# Altium schematic sheet Schematic.SchDoc
size A; DocumentNumber: 1; SheetNumber: 1; SheetTotal: 2
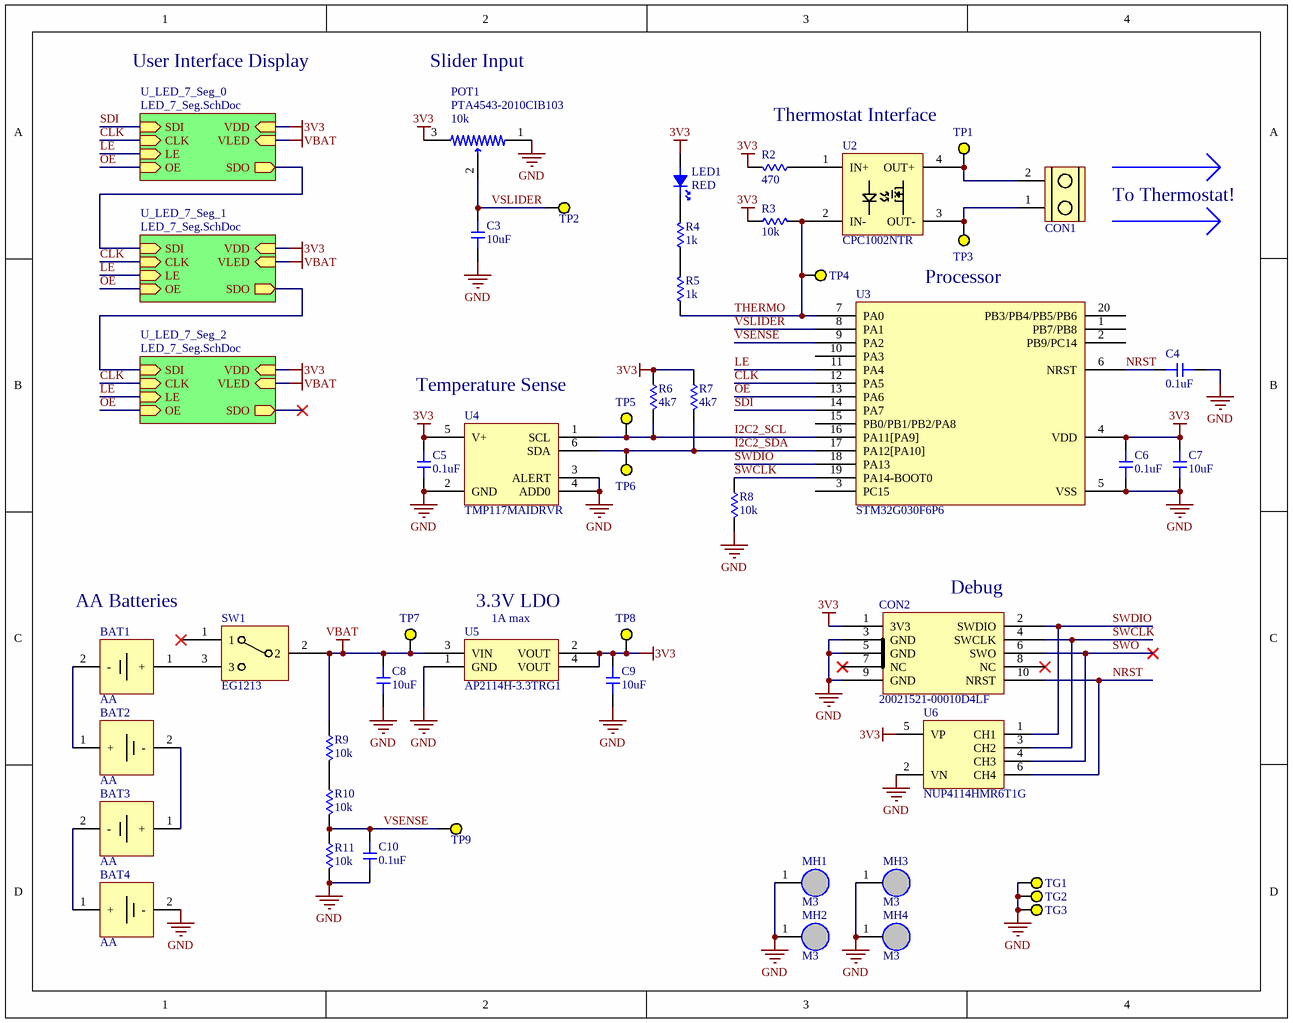
[diagram p0: Schematic.SchDoc]

## Parts
BAT1  AA  [AA_BATTERY]
BAT2  AA  [AA_BATTERY]
BAT3  AA  [AA_BATTERY]
BAT4  AA  [AA_BATTERY]
C3  value 10uF  [0603-CAP]  (hidden comment: Capacitor)
C4  value 0.1uF  [0603-CAP]  (hidden comment: Capacitor)
C5  value 0.1uF  [0603-CAP]  (hidden comment: Capacitor)
C6  value 0.1uF  [0603-CAP]  (hidden comment: Capacitor)
C7  value 10uF  [0603-CAP]  (hidden comment: Capacitor)
C8  value 10uF  [0603-CAP]  (hidden comment: Capacitor)
C9  value 10uF  [0603-CAP]  (hidden comment: Capacitor)
C10  value 0.1uF  [0603-CAP]  (hidden comment: Capacitor)
CON1  ScrewTerminal_1x2  [1935161]  (value not drawn)
CON2  20021521-00010D4LF  [20021521-00010D4LF]
LED1  RED  [0603-LED]
MH1  M3  [M3_HOLE]  (no BOM)
MH2  M3  [M3_HOLE]  (no BOM)
MH3  M3  [M3_HOLE]  (no BOM)
MH4  M3  [M3_HOLE]  (no BOM)
POT1  PTA4543-2010CIB103  value 10k  [PTA4543-2010CIB103]
R2  value 470  [0603-RES]  (hidden comment: Resistor)
R3  value 10k  [0603-RES]  (hidden comment: Resistor)
R4  value 1k  [0603-RES]  (hidden comment: Resistor)
R5  value 1k  [0603-RES]  (hidden comment: Resistor)
R6  value 4k7  [0603-RES]  (hidden comment: Resistor)
R7  value 4k7  [0603-RES]  (hidden comment: Resistor)
R8  value 10k  [0603-RES]  (hidden comment: Resistor)
R9  value 10k  [0603-RES]  (hidden comment: Resistor)
R10  value 10k  [0603-RES]  (hidden comment: Resistor)
R11  value 10k  [0603-RES]  (hidden comment: Resistor)
SW1  EG1213  [EG1213]
TG1  RCU-0C  [RCU-0C]  (value not drawn)
TG2  RCU-0C  [RCU-0C]  (value not drawn)
TG3  RCU-0C  [RCU-0C]  (value not drawn)
TP1  RCU-0C  [RCU-0C]  (value not drawn)
TP2  RCU-0C  [RCU-0C]  (value not drawn)
TP3  RCU-0C  [RCU-0C]  (value not drawn)
TP4  RCU-0C  [RCU-0C]  (value not drawn)
TP5  RCU-0C  [RCU-0C]  (value not drawn)
TP6  RCU-0C  [RCU-0C]  (value not drawn)
TP7  RCU-0C  [RCU-0C]  (value not drawn)
TP8  RCU-0C  [RCU-0C]  (value not drawn)
TP9  RCU-0C  [RCU-0C]  (value not drawn)
U2  CPC1002NTR  [CPC1002NTR]
U3  STM32G030F6P6  [TSOP65P640X120-20N]
U4  TMP117MAIDRVR  [SON65P200X80_HS-7N]
U5  AP2114H-3.3TRG1  [SOT230P700X180-4N]
U6  NUP4114HMR6T1G  [TSOP95P280X110-6N]

## Sub-sheets
U_LED_7_Seg_0 = LED_7_Seg.SchDoc: VLED (in), VDD (in), CLK (in), SDI (in), SDO (out), LE (in), OE (in)
U_LED_7_Seg_1 = LED_7_Seg.SchDoc: VLED (in), VDD (in), CLK (in), SDI (in), SDO (out), LE (in), OE (in)
U_LED_7_Seg_2 = LED_7_Seg.SchDoc: VLED (in), VDD (in), CLK (in), SDI (in), SDO (out), LE (in), OE (in)

## Nets
3V3: C5.1 C6.1 C7.1 C9.1 CON2.1(3V3) LED1.A POT1.3 R2.2 R3.1 R6.1 R7.1 TP8.1 U3.4(VDD) U4.5(V+) U5.2(VOUT) U5.4(VOUT) U6.5(VP) ; sheet U_LED_7_Seg_0/VDD, sheet U_LED_7_Seg_1/VDD, sheet U_LED_7_Seg_2/VDD
GND: BAT4.2(-) C3.2 C4.1 C5.2 C6.2 C7.2 C8.2 C9.2 C10.2 CON2.3(GND) CON2.5(GND) CON2.9(GND) MH1.1 MH2.1 MH3.1 MH4.1 POT1.1 R8.2 R11.2 TG1.1 TG2.1 TG3.1 U3.5(VSS) U4.2(GND) U4.3(ALERT) U4.4(ADD0) U5.1(GND) U6.2(VN)
VBAT: C8.1 R9.1 SW1.2 TP7.1 U5.3(VIN) ; sheet U_LED_7_Seg_0/VLED, sheet U_LED_7_Seg_1/VLED, sheet U_LED_7_Seg_2/VLED
CLK: U3.12(PA5) ; sheet U_LED_7_Seg_0/CLK, sheet U_LED_7_Seg_1/CLK, sheet U_LED_7_Seg_2/CLK
I2C2_SCL: R6.2 TP5.1 U3.16(PA11[PA9]) U4.1(SCL)
I2C2_SDA: R7.2 TP6.1 U3.17(PA12[PA10]) U4.6(SDA)
LE: U3.11(PA4) ; sheet U_LED_7_Seg_0/LE, sheet U_LED_7_Seg_1/LE, sheet U_LED_7_Seg_2/LE
NRST: C4.2 CON2.10(NRST) U3.6(NRST) U6.6(CH4)
OE: U3.13(PA6) ; sheet U_LED_7_Seg_0/OE, sheet U_LED_7_Seg_1/OE, sheet U_LED_7_Seg_2/OE
SDI: U3.14(PA7) ; sheet U_LED_7_Seg_0/SDI
SWCLK: CON2.4(SWCLK) R8.1 U3.19(PA14-BOOT0) U6.3(CH2)
SWDIO: CON2.2(SWDIO) U3.18(PA13) U6.1(CH1)
SWO: CON2.6(SWO) U6.4(CH3)
THERMO: R3.2 R5.1 TP4.1 U2.2(IN-) U3.7(PA0)
VSENSE: C10.1 R10.2 R11.1 TP9.1 U3.9(PA2)
VSLIDER: C3.1 POT1.2 TP2.1 U3.8(PA1)
NetBAT1_1: BAT1.1(+) SW1.3
NetBAT1_2: BAT1.2(-) BAT2.1(+)
NetBAT2_2: BAT2.2(-) BAT3.1(+)
NetBAT3_2: BAT3.2(-) BAT4.1(+)
NetCON1_1: CON1.1 TP3.1 U2.3(OUT-)
NetCON1_2: CON1.2 TP1.1 U2.4(OUT+)
NetLED1_C: LED1.C R4.2
NetR2_1: R2.1 U2.1(IN+)
NetR4_1: R4.1 R5.2
NetR9_2: R9.2 R10.1
(unnamed): sheet U_LED_7_Seg_0/SDO, sheet U_LED_7_Seg_1/SDI
(unnamed): sheet U_LED_7_Seg_1/SDO, sheet U_LED_7_Seg_2/SDI

Not connected (* = marked no-connect by the designer): CON2 7(NC)* 8(NC)*; SW1 1*; U3 1(PB7/PB8) 2(PB9/PC14) 3(PC15) 10(PA3) 15(PB0/PB1/PB2/PA8) 20(PB3/PB4/PB5/PB6)

## Notes on the sheet
- User Interface Display
- Slider Input
- Thermostat Interface
- To Thermostat!
- Processor
- Temperature Sense
- AA Batteries
- (near U5) 1A max
- (near U5) 3.3V LDO
- (near CON2) Debug

## Library data of the parts
BAT1-BAT4 = AA_BATTERY: AA BATTERY; Supplier 1: Digi-Key; Supplier Part Number 1: 36-590-ND; Supplier Part Number 2: 36-596-ND
CON2 = 20021521-00010D4LF: CONN HEADER SMD 10POS 1.27MM; Supplier 1: Digi-Key; Supplier Part Number 1: 609-6533-ND
LED1 = LED: Value: RED; Supplier 1: Digi-Key; Supplier Part Number 1: 160-1447-6-ND
MH1-MH4 = M3_HOLE: M3 MOUNTING HOLE
POT1 = PTA4543-2010CIB103: SLIDE POT 10K OHM 0.25W TOP 45MM; Supplier Part Number 1: PTA4543-2010CIB103-ND; Supplier 1: Digi-Key
SW1 = EG1213: SWITCH SLIDE SPDT 200MA 30V; Supplier 1: Digi-Key; Supplier Part Number 1: EG1906-ND
TG1-TG3 TP1-TP9 = CMP-2000-05575-1: PC TEST POINT NATURAL; Supplier 1: Digi-Key; Supplier Part Number 1: A106145CT-ND; ComponentLink1URL: https://datasheet.ciiva.com/2917/5000-5004-2917632.pdf?src-supplier=Digi-Key; ComponentLink1Description: https://datasheet.ciiva.com/2917/5000-5004-2917632.pdf?src-supplier=Digi-Key; ComponentLink2URL: https://datasheet.ciiva.com/16507/m60-2p60-16507925.pdf?src-supplier=Future+Electronics; ComponentLink2Description: https://datasheet.ciiva.com/16507/m60-2p60-16507925.pdf?src-supplier=Future+Electronics; ComponentLink3URL: https://datasheet.ciiva.com/1454/1703983-1454827.pdf?src-supplier=Element14; ComponentLink3Description: https://datasheet.ciiva.com/1454/1703983-1454827.pdf?src-supplier=Element14
U2 = CPC1002NTR: SSR RELAY SPST-NO 700MA 0-60V; Supplier 1: Digi-Key; Supplier Part Number 1: CLA230CT-ND
U3 = STM32G030F6P6: ARM MICROCONTROLLERS - MCU; Supplier 1: Digi-Key; Supplier Part Number 1: 497-STM32G030F6P6-ND
U4 = TMP117MAIDRVR: TEMPERATURE SENSOR; Supplier Part Number 1: 296-51835-1-ND; Supplier 1: Digi-Key
U5 = AP2114H-3.3TRG1: IC REG LINEAR 3.3V 1A SOT223; Supplier 1: Digi-Key; Supplier Part Number 1: AP2114H-3.3TRG1DICT-ND
U6 = NUP4114HMR6T1G: TVS DIODE 5.5V 10V 6TSOP; Supplier 1: Digi-Key; Supplier Part Number 1: NUP4114HMR6T1GOSCT-ND
C3-C10 = Capacitor: Supplier 1: Digi-Key
  C3 C7-C9: Supplier Part Number 1: 1276-1192-1-ND
  C4-C6 C10: Supplier Part Number 1: 311-1343-1-ND
CON1 = ScrewTerminal_1x2: Supplier 1: Digi-Key; Supplier Part Number 1: 277-1667-ND
R2-R11 = Resistor: ComponentLink1URL: https://www.seielect.com/catalog/SEI-RMCF_RMCP.pdf?src-supplier=Avnet; ComponentLink1Description: https://www.seielect.com/catalog/SEI-RMCF_RMCP.pdf?src-supplier=Avnet; ComponentLink2URL: http://components.arrow.com/part/dataview/50497142S181428N1174?src-supplier=Arrow; ComponentLink2Description: http://components.arrow.com/part/dataview/50497142S181428N1174?src-supplier=Arrow; ComponentLink3URL: https://www.seielect.com/catalog/SEI-Packaging.pdf?src-supplier=Digi-Key; ComponentLink3Description: https://www.seielect.com/catalog/SEI-Packaging.pdf?src-supplier=Digi-Key; Supplier 1: Digi-Key
  R2: Supplier Part Number 1: 311-470HRCT-ND
  R3 R8-R11: Supplier Part Number 1: 311-10.0KHRCT-ND
  R4 R5: Supplier Part Number 1: 311-1.00KHRCT-ND
  R6 R7: Supplier Part Number 1: YAG1304CT-ND